# Altium schematic sheet V_1.SchDoc
size A4
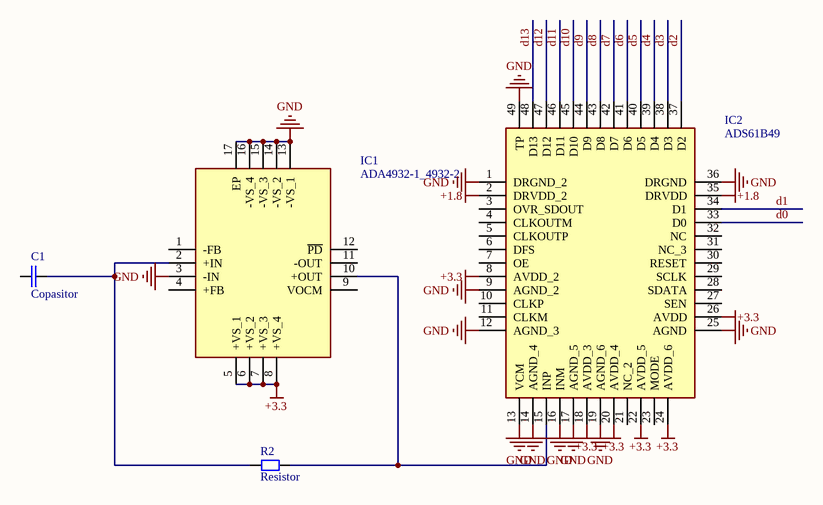
[diagram p0: V_1.SchDoc]

## Parts
C1  Copasitor  [Copasitor]
IC1  ADA4932-1_4932-2  [ADA4932-1]
IC2  ADS61B49  [ADS61b49]
R2  Resistor  [Resistor]

## Nets
+1.8: IC2.2(DRVDD_2) IC2.35(DRVDD)
+3.3: IC1.5(+VS_1) IC1.6(+VS_2) IC1.7(+VS_3) IC1.8(+VS_4) IC2.8(AVDD_2) IC2.18(AVDD_3) IC2.20(AVDD_4) IC2.22(AVDD_5) IC2.24(AVDD_6) IC2.26(AVDD)
GND: IC1.3(-IN) IC1.13(-VS_1) IC1.14(-VS_2) IC1.15(-VS_3) IC1.16(-VS_4) IC1.17(EP) IC2.1(DRGND_2) IC2.9(AGND_2) IC2.12(AGND_3) IC2.13(VCM) IC2.14(AGND_4) IC2.16(INM) IC2.17(AGND_5) IC2.19(AGND_6) IC2.25(AGND) IC2.36(DRGND) IC2.49(TP)
d0: IC2.33(D0)
d1: IC2.34(D1)
d2: IC2.37(D2)
d3: IC2.38(D3)
d4: IC2.39(D4)
d5: IC2.40(D5)
d6: IC2.41(D6)
d7: IC2.42(D7)
d8: IC2.43(D8)
d9: IC2.44(D9)
d10: IC2.45(D10)
d11: IC2.46(D11)
d12: IC2.47(D12)
d13: IC2.48(D13)
NetC1_2: C1.2 IC1.2(+IN) R2.1
NetIC1_10: IC1.10(+OUT) IC2.15(INP) R2.2

Not connected (* = marked no-connect by the designer): C1 1; IC1 1(-FB) 4(+FB) 9(VOCM) 11(-OUT) 12(~{PD}); IC2 3(OVR_SDOUT) 4(CLKOUTM) 5(CLKOUTP) 6(DFS) 7(OE) 10(CLKP) 11(CLKM) 21(NC_2) 23(MODE) 27(SEN) 28(SDATA) 29(SCLK) 30(RESET) 31(NC_3) 32(NC)